# EAGLE design adapter_for_main_board (EAGLE 9.6.2)
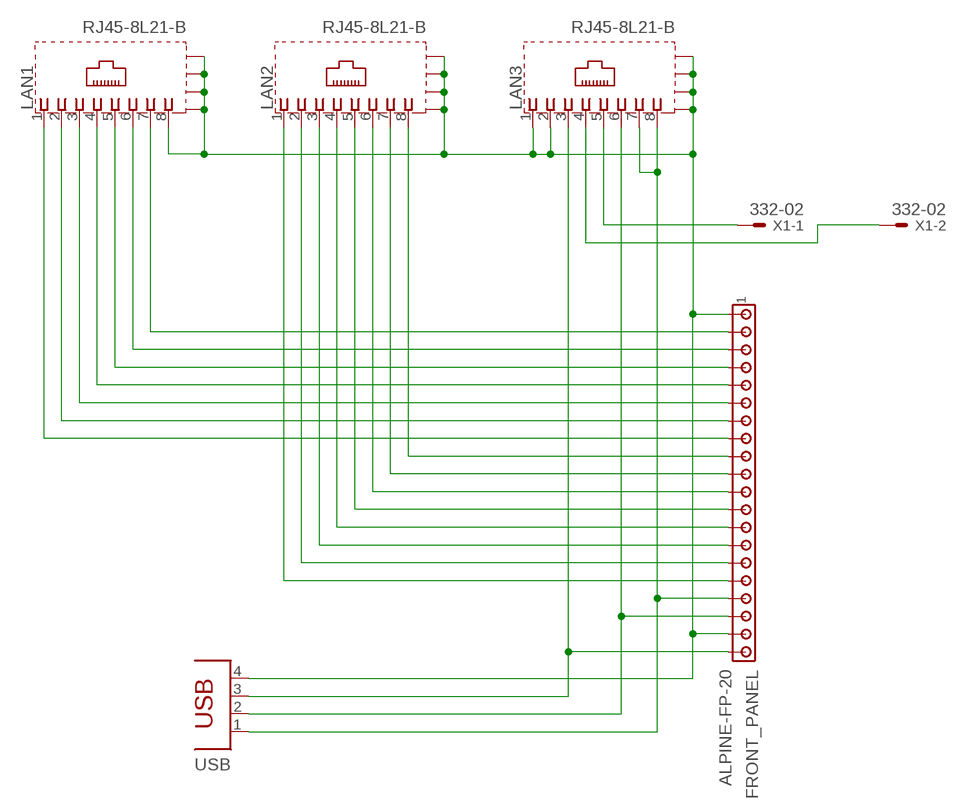
[diagram p0: schematic, sheet 1]

## Parts
FRONT_PANEL  ALPINE-FP-20  [ALPINE-FP-20]
LAN1  RJ45-8L21-B  [RJ45-SHIELD1]
LAN2  RJ45-8L21-B  [RJ45-SHIELD1]
LAN3  RJ45-8L21-B  [RJ45-SHIELD1]
USB  PN87520  [PN87520]
X1  332-02  [332-02]

## Nets
GND: FRONT_PANEL.1 FRONT_PANEL.19 LAN1.8 LAN1.S1(S) LAN1.S2(S) LAN1.S3(S) LAN1.S4(S) LAN2.S1(S) LAN2.S2(S) LAN2.S3(S) LAN2.S4(S) LAN3.1 LAN3.2 LAN3.S1(S) LAN3.S2(S) LAN3.S3(S) LAN3.S4(S) USB.4
N$1: FRONT_PANEL.17 LAN3.7 LAN3.8 USB.1
N$2: FRONT_PANEL.18 LAN3.6 USB.2
N$4: FRONT_PANEL.20 LAN3.3 USB.3
N$5: FRONT_PANEL.2 LAN1.7
N$6: FRONT_PANEL.3 LAN1.6
N$7: FRONT_PANEL.4 LAN1.5
N$8: FRONT_PANEL.5 LAN1.4
N$9: FRONT_PANEL.6 LAN1.3
N$10: FRONT_PANEL.7 LAN1.2
N$11: FRONT_PANEL.8 LAN1.1
N$12: FRONT_PANEL.9 LAN2.8
N$13: FRONT_PANEL.10 LAN2.7
N$14: FRONT_PANEL.11 LAN2.6
N$15: FRONT_PANEL.12 LAN2.5
N$16: FRONT_PANEL.13 LAN2.4
N$17: FRONT_PANEL.14 LAN2.3
N$18: FRONT_PANEL.15 LAN2.2
N$19: FRONT_PANEL.16 LAN2.1
N$20: LAN3.5 X1.1
N$21: LAN3.4 X1.2

## Library data of the parts
FRONT_PANEL = con-alpine:ALPINE-FP-20: Alpine front panel connector
LAN1-LAN3 = con-tycoelectronics:RJ45*2: RJ45 Low Profile Shield Type 2 For all RJ45 L, LC, LCT and X Series Models Source: www.tycoelectronics.com .. ENG_DS_1654001_1099_RJ_L_0507.pdf; OC_FARNELL: unknown; OC_NEWARK: unknown
USB = con-berg:PN87520: BERG USB connector; OC_FARNELL: unknown; OC_NEWARK: unknown
X1 = con-garry:332-02: 2 Pin - 2mm Dual Row Source: www.mpe-connector.de / garry_shortform_2012.pdf

## Board
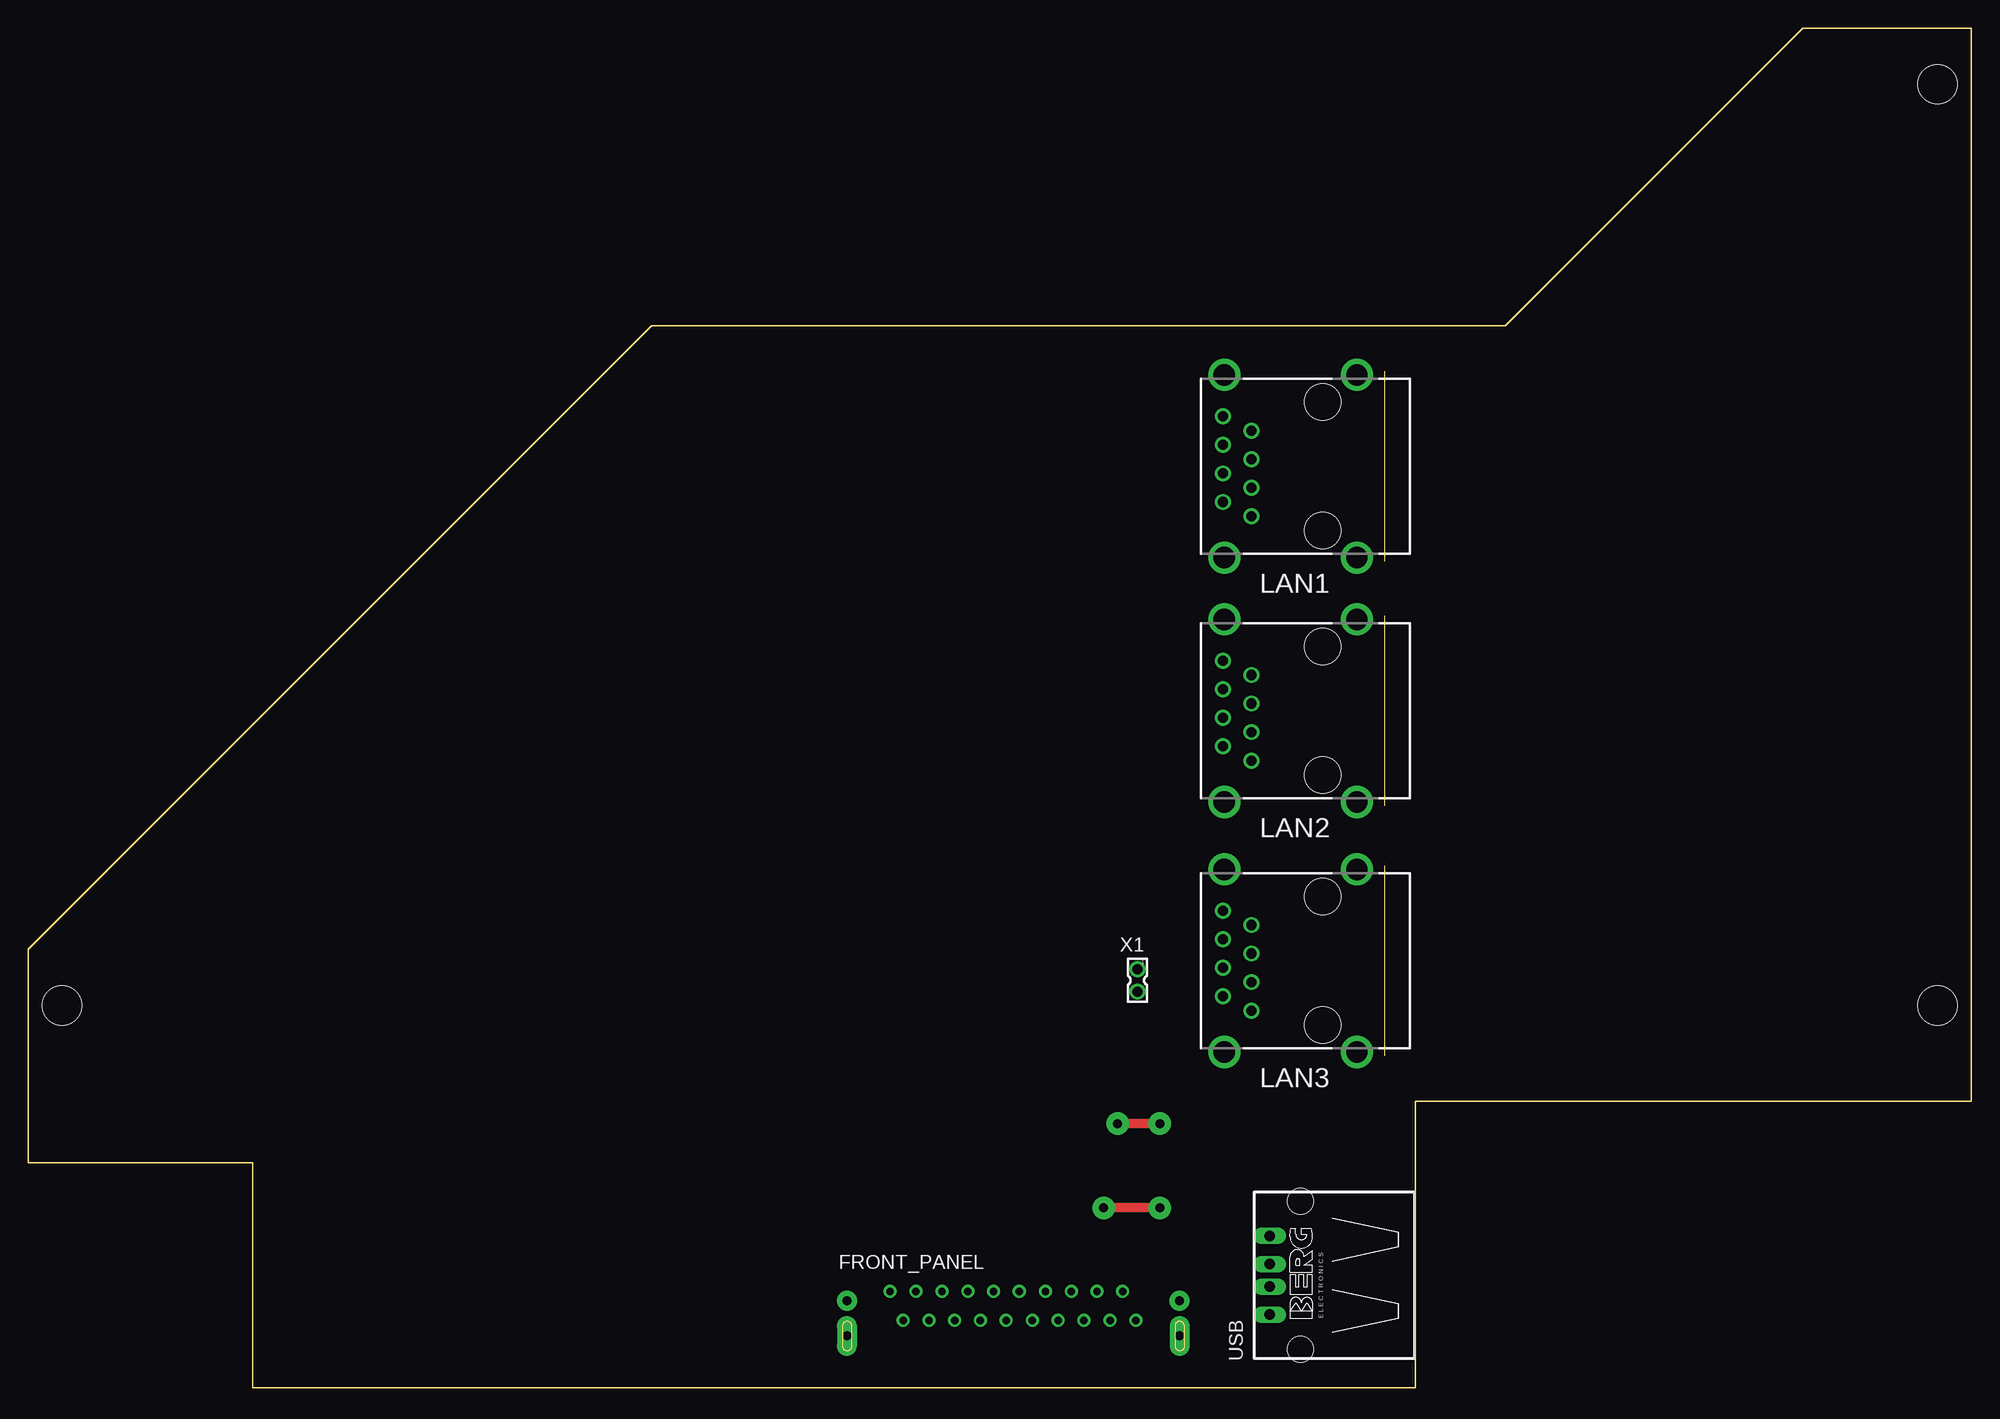
[diagram p1: board, top side]
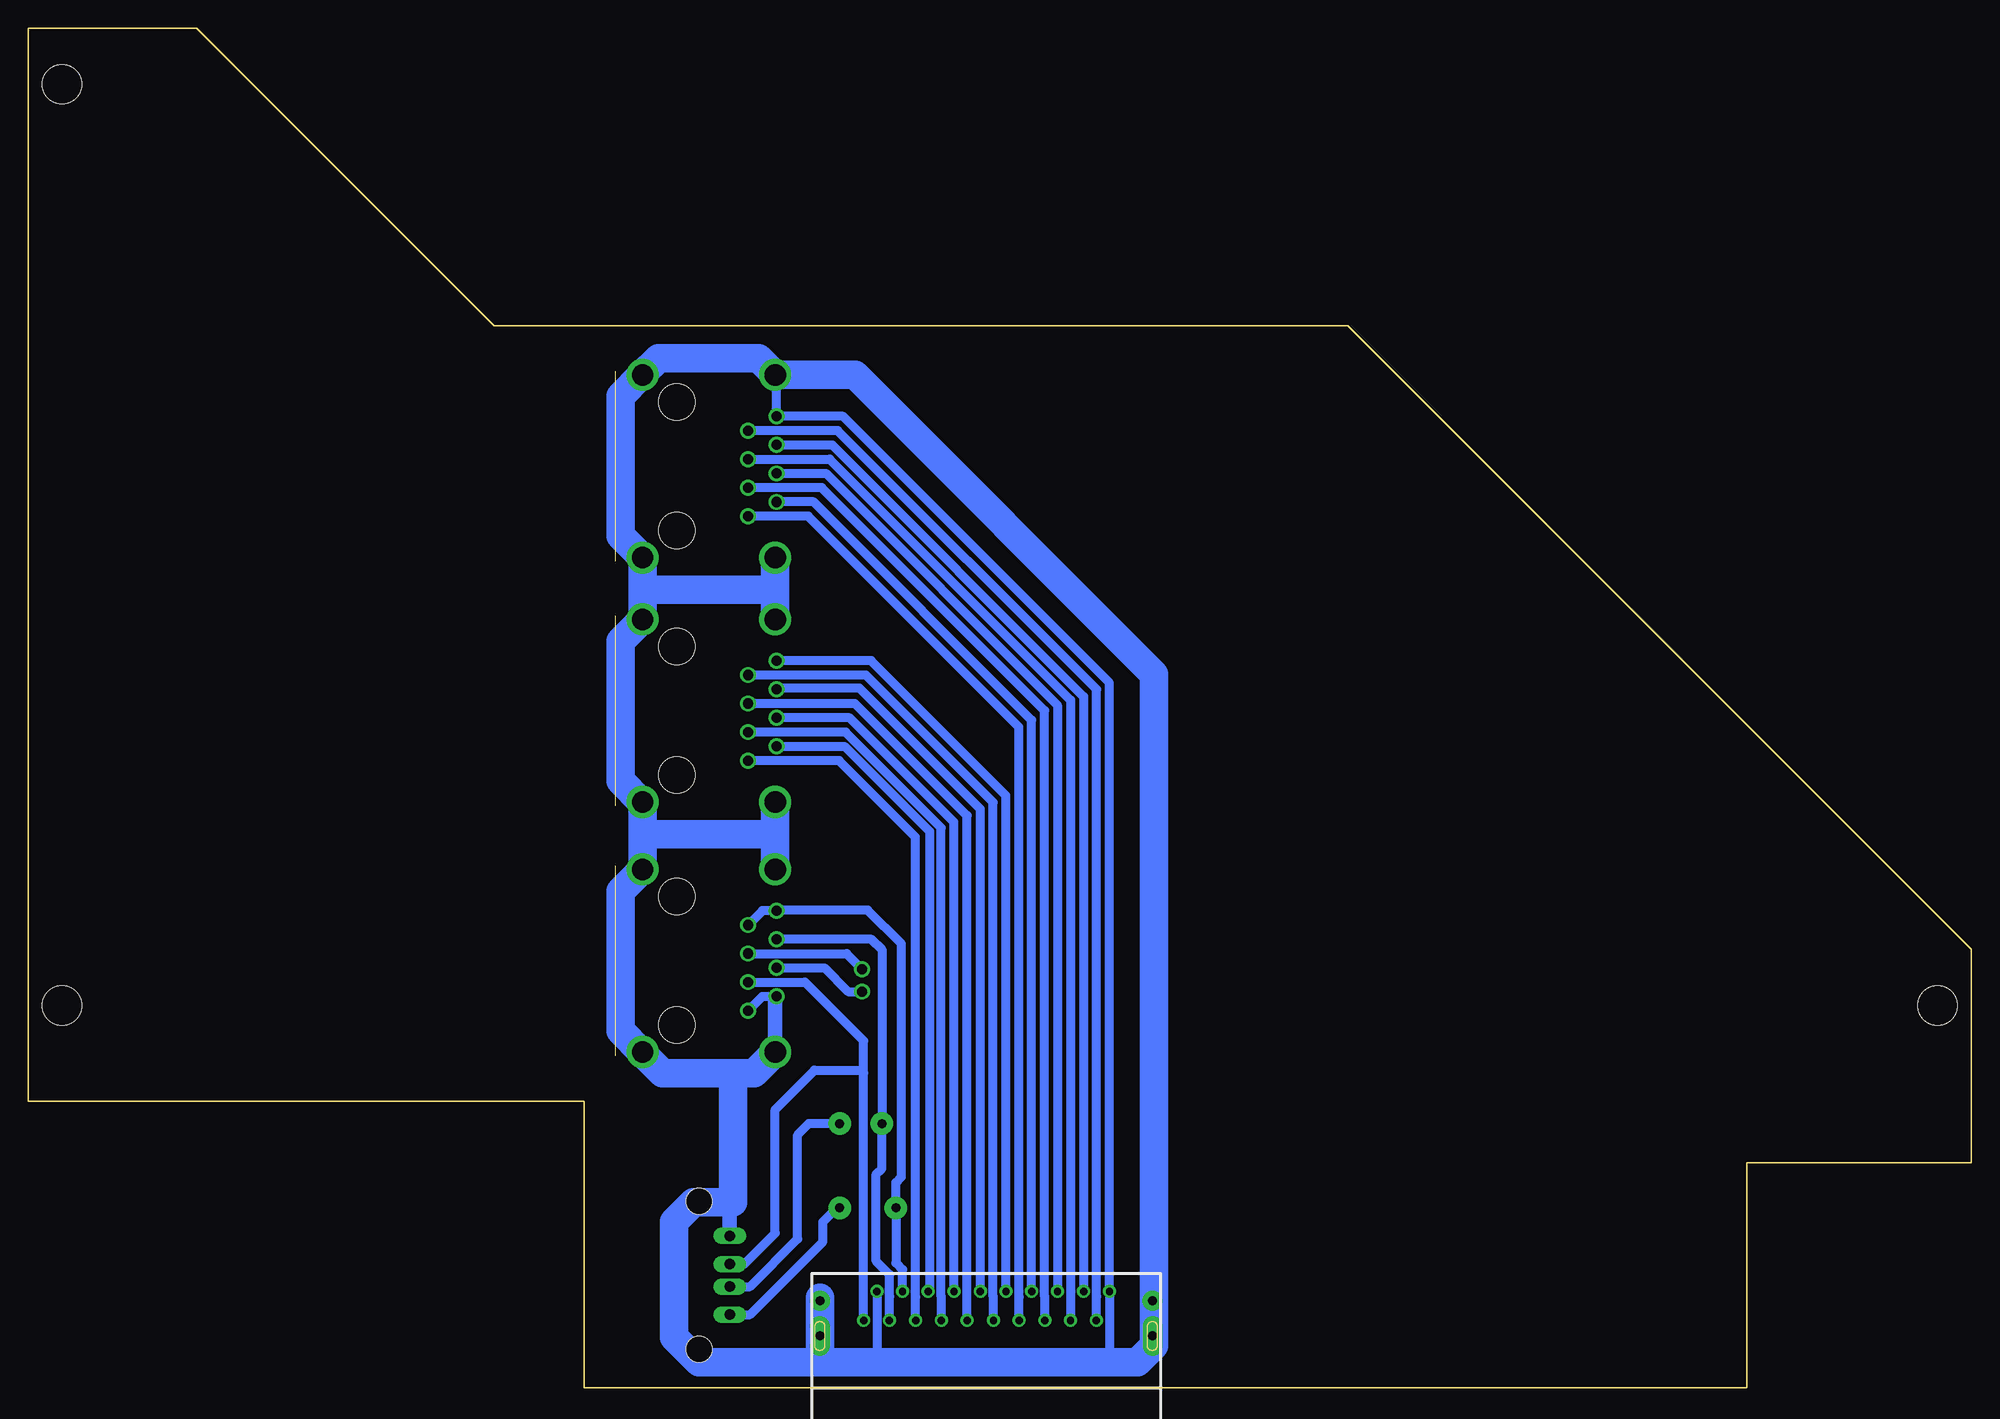
[diagram p2: board, bottom side, seen from below]

Size 173 x 121 mm. Coordinates in mm from the lower left corner, seen from the top.
Outline: 20,0 20,20 0,20 0,39 55.5,94.5 131.5,94.5 158,121 173,121 173,25.5 123.5,25.5 123.5,0 20,0
Copper layers (1*16): Top 0.035mm / dielectric 1.5mm / Bottom 0.035mm
Design rules "default": minimum track width 6mil, minimum drill 0.35mm, track to track 6mil, track to pad 6mil, pad to pad 6mil, via to via 6mil, smd to smd 6mil, copper to edge 40mil, drill to drill 6mil, minimum pad ring 10mil, minimum via ring 8mil, stop-mask expansion 4mil, vias tented up to drill 0mil, thermal gap 10mil
Holes 3.5 mm at 3,34 170,34 170,116

### Footprints (pad centres in the part's own frame; a part is rotated, then mirrored left to right if it is on the bottom)
ALPINE-FP-20 = drill 0.65: 1 -9.865,1.37; 2 -8.695,-1.22; 3 -7.575,1.37; 4 -6.405,-1.22; 5 -5.235,1.37; 6 -4.115,-1.22; 7 -2.945,1.37; 8 -1.825,-1.22; 9 -0.655,1.37; 10 0.465,-1.22; 11 1.635,1.37; 12 2.805,-1.22; 13 3.975,1.37; 14 5.095,-1.22; 15 6.265,1.37; 16 7.385,-1.22; 17 8.555,1.37; 18 9.725,-1.22; 19 10.845,1.37; 20 12.015,-1.22 | drill 0.8 pad 1.778: P$1 -13.7,0.55; P$2 15.9,0.55 | drill 0.8 pad 1.778 long: P$3 -13.7,-2.6; P$4 15.9,-2.6
RJ45-SHIELD1 = drill 0.9 pad 1.4: 1 -4.445,6.35; 2 -3.175,8.89; 3 -1.905,6.35; 4 -0.635,8.89; 5 0.635,6.35; 6 1.905,8.89; 7 3.175,6.35; 8 4.445,8.89 | drill 1.9 pad 2.5: S1 -8.128,-3.048; S2 8.128,-3.048; S3 -8.128,8.76; S4 8.128,8.76 | hole 3.251: -5.715,0; 5.715,0
PN87520 = drill 0.95 long: 1 -3.5,2.71; 2 -1,2.71; 3 1,2.71; 4 3.5,2.71 | hole 2.3: -6.57,0; 6.57,0
332-02 = drill 0.9 pad 1.27: 1 0,-1; 2 0,1

### Placement (x,y rotation side)
FRONT_PANEL  86.6,7.2 0 top
LAN1  115.25,82 90 top
LAN2  115.25,60.25 90 top
LAN3  115.25,38 90 top
USB  113.25,10 90 top
X1  98.75,36.25 180 top

### Tracks (layer width: path | path; a pad name or v marks a point on that pad's centre or on a via)
GND
  Bottom 0.813: 106.36,30 LAN3.S3 | LAN3.1 107.63,34.83 LAN3.2 | FRONT_PANEL.19 97.44,2.31 97.5,2.25 | 76.75,2.25 76.73,2.27 FRONT_PANEL.1 76.73,62.73 100.44,86.44 LAN1.8 106.36,90 LAN1.S4
  Bottom 1.27: USB.4 110.54,16.21 110.25,16.5 | LAN3.S3 106.49,34.7 LAN3.2
  Bottom 2.54: 118.3,71 LAN2.S2 120.25,66.43 120.25,54 118.37,52.12 LAN2.S1 118.3,49.25 | 118.3,71 LAN1.S1 120.25,75.82 120.25,88.25 118.37,90.13 | LAN2.S4 106.49,71 | 106.49,71 LAN1.S3 | 106.49,71 118.3,71 | LAN3.S4 106.49,49.25 | 106.49,49.25 LAN2.S3 | 118.3,49.25 LAN3.S2 120.25,44.18 120.25,31.75 118.37,29.87 | 106.49,49.25 118.3,49.25 | LAN3.S3 108.36,28 110.25,28 | 110.25,28 116.5,28 118.37,29.87 | 118.37,29.87 LAN3.S1 | 102.5,2.25 97.5,2.25 76.75,2.25 74.25,2.25 72.75,3.75 72.75,63.5 99.38,90.13 LAN1.S4 107.99,91.63 116.87,91.63 118.37,90.13 | 102.5,2.25 113.25,2.25 115.5,4.5 115.5,14.75 113.75,16.5 110.25,16.5 110.25,28 | 102.5,2.25 102.5,8 | 118.37,90.13 LAN1.S2
N$1  (via drill 0.8 pad 2)
  Top 0.813: v100.75,16 v95.75,16
  Bottom 0.813: LAN3.7 107.63,42.45 LAN3.8 106.31,42.5 98.25,42.5 95.25,39.5 95.25,18.75 95.75,18.25 v95.75,16 95.75,11.1 95.16,10.5 FRONT_PANEL.17 | USB.1 108.75,6.5 102.25,13 102.25,14.75 101,16 v100.75,16
N$2  (via drill 0.8 pad 2)
  Top 0.813: v100.75,23.5 v97,23.5
  Bottom 0.813: LAN3.6 97.91,39.91 97,39 v97,23.5 97,19.5 97.5,19 97.5,11.25 96.31,10.06 96.31,8.1 96.33,8.08 FRONT_PANEL.18 | USB.2 108.75,9 104.5,13.25 104.5,22.5 103.5,23.5 v100.75,23.5
N$4
  Bottom 0.813: LAN3.3 103.84,36.09 98.61,30.86 98.61,28 | FRONT_PANEL.20 98.61,28 | USB.3 109.25,11 106.5,13.75 106.5,24.75 103,28.25 98.86,28.25 98.61,28
N$5
  Bottom 0.813: FRONT_PANEL.2 77.91,8.08 77.89,8.1 77.89,62.14 100.92,85.17 LAN1.7
N$6
  Bottom 0.813: FRONT_PANEL.3 79.03,61.51 101.42,83.91 LAN1.6
N$7
  Bottom 0.813: 108.89,82.63 LAN1.5 101.64,82.64 80.19,61.2 FRONT_PANEL.4
N$8
  Bottom 0.813: FRONT_PANEL.5 81.36,60.75 101.98,81.36 LAN1.4
N$9
  Bottom 0.813: FRONT_PANEL.6 82.48,8.08 82.5,8.1 82.5,60.25 102.34,80.09 LAN1.3
N$10
  Bottom 0.813: FRONT_PANEL.7 83.66,59.41 103.08,78.83 LAN1.2
N$11
  Bottom 0.813: FRONT_PANEL.8 84.78,8.08 84.79,8.1 84.79,58.79 103.56,77.56 LAN1.1
N$12
  Bottom 0.813: LAN2.8 97.94,64.69 85.94,52.7 FRONT_PANEL.9
N$13
  Bottom 0.813: LAN2.7 98.42,63.42 87.08,52.08 87.08,8.1 87.06,8.08 FRONT_PANEL.10
N$14
  Bottom 0.813: FRONT_PANEL.11 88.23,51.48 99,62.25 106.27,62.25 LAN2.6
N$15
  Bottom 0.813: LAN2.5 99.39,60.88 89.41,50.91 FRONT_PANEL.12 89.37,6.01
N$16
  Bottom 0.813: FRONT_PANEL.13 90.58,50.33 99.86,59.62 LAN2.4
N$17
  Bottom 0.813: FRONT_PANEL.14 91.69,8.08 91.71,8.1 91.71,49.83 100.22,58.34 LAN2.3
N$18
  Bottom 0.813: LAN2.2 100.33,57.08 92.75,49.5 92.75,8.69 FRONT_PANEL.15
N$19
  Bottom 0.813: FRONT_PANEL.16 93.98,8.08 94,8.1 94,49 100.81,55.8 LAN2.1
N$20
  Bottom 0.813: LAN3.5 100.14,38.63 X1.1
N$21
  Bottom 0.813: LAN3.4 102.11,37.37 100,35.25 X1.2